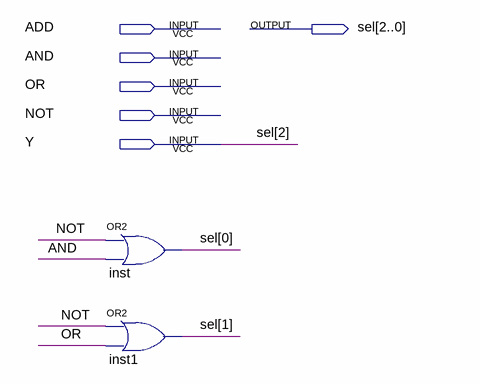
[diagram p0: schematic sheet]
// Quartus schematic codULA.bdf as structural Verilog: 2 symbols, 6 pins
module codULA (
  input  ADD,
  input  AND,
  input  OR,
  input  NOT,
  input  Y,
  output [2:0] sel
);

  or inst (sel[0], NOT, AND);
  or inst1 (sel[1], NOT, OR);

  assign sel[2] = Y;
endmodule
